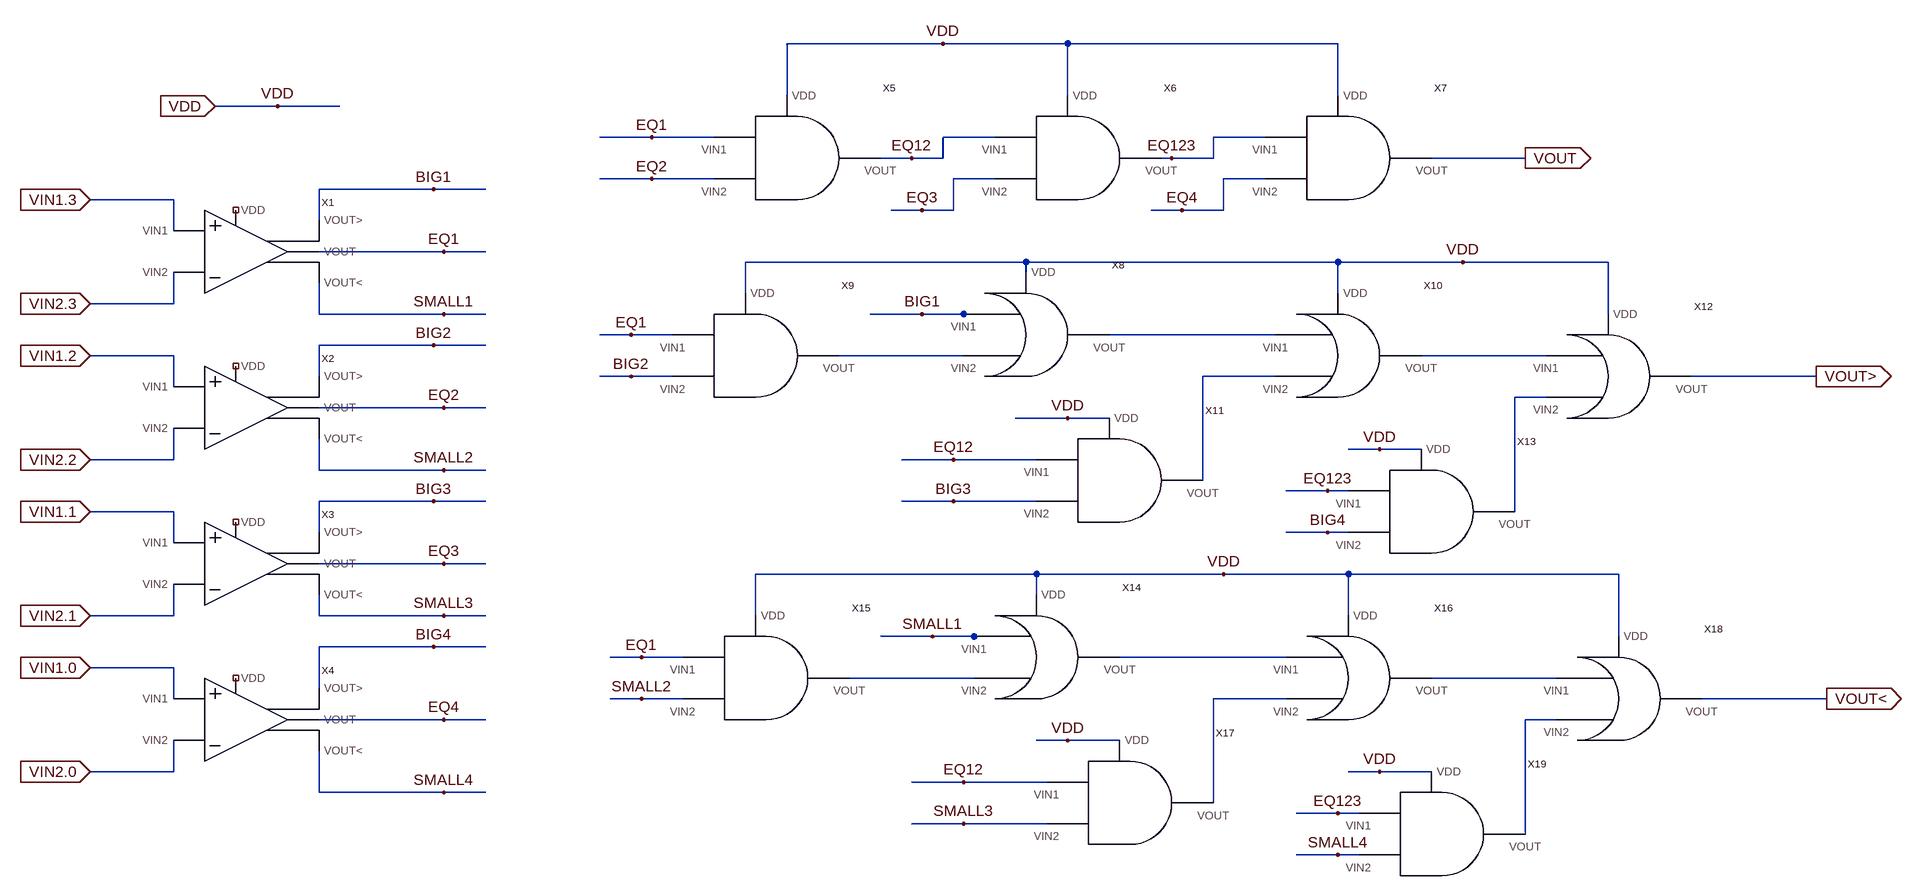
[diagram p0: schematic Comparator4bit.asc]
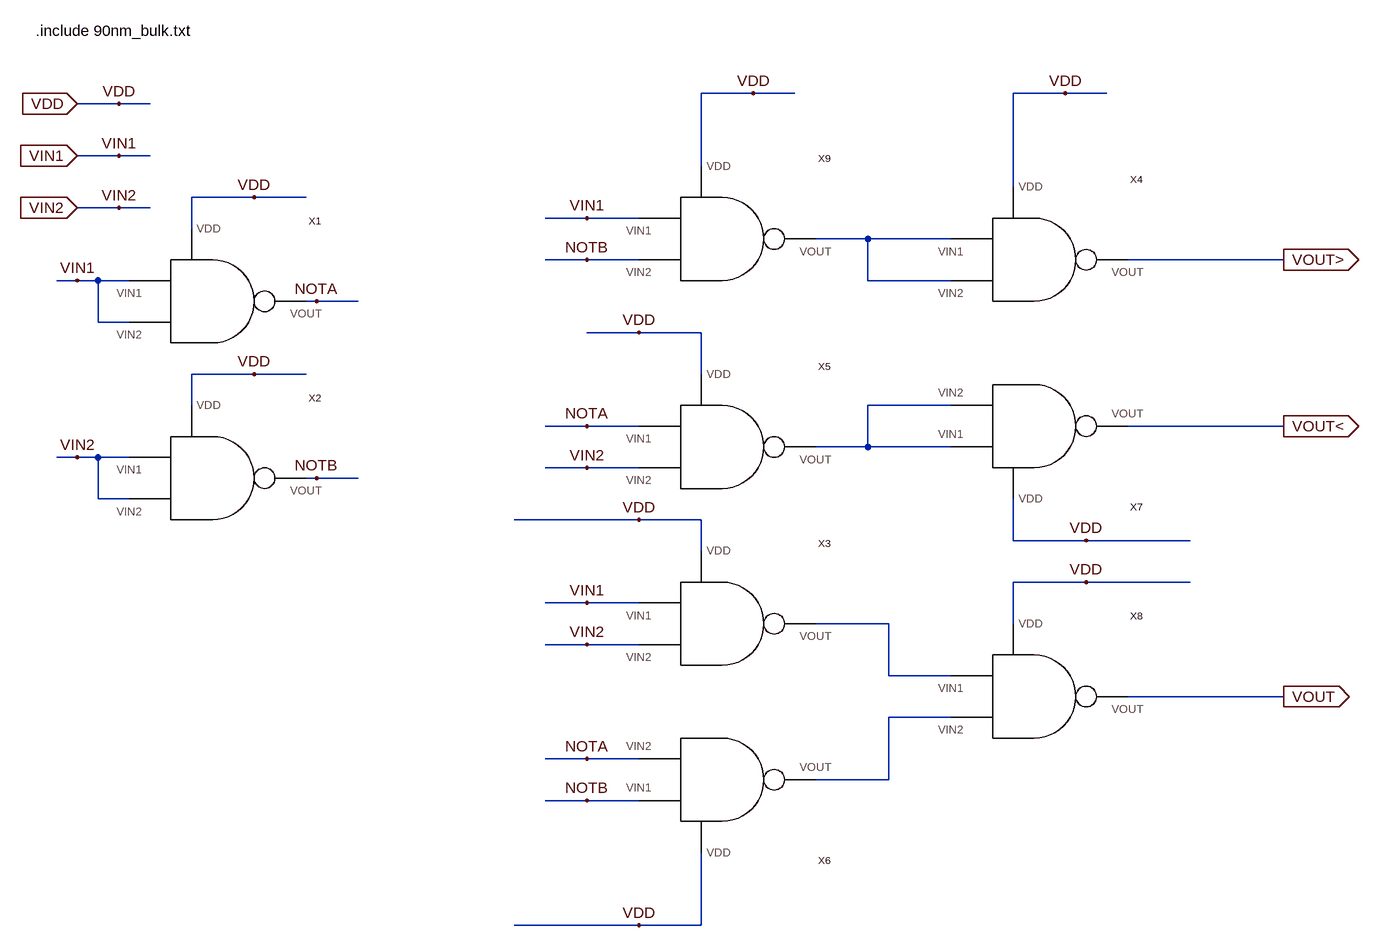
[diagram p1: sub-circuit comparator.asc]
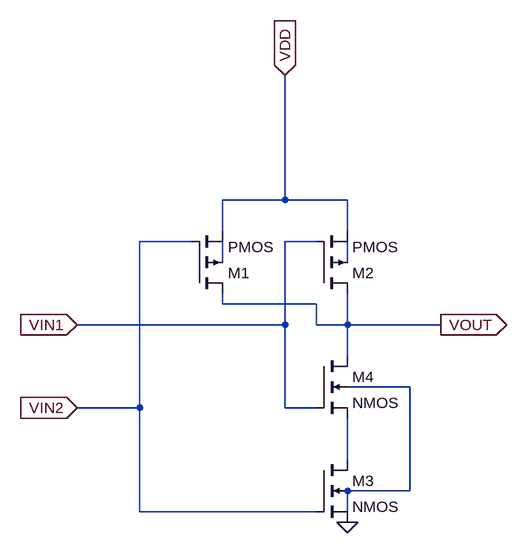
[diagram p2: sub-circuit nand.asc]
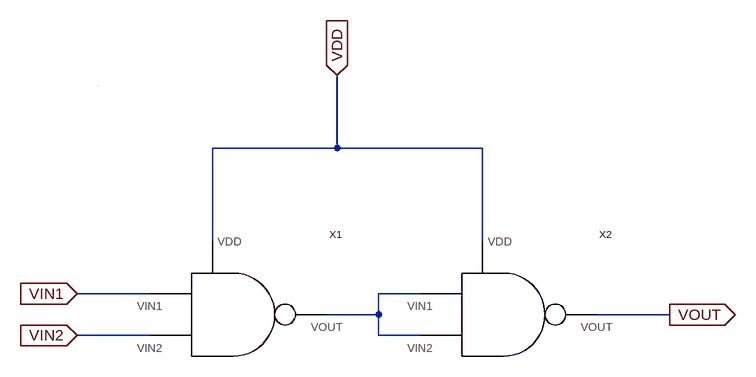
[diagram p3: sub-circuit andbynand.asc]
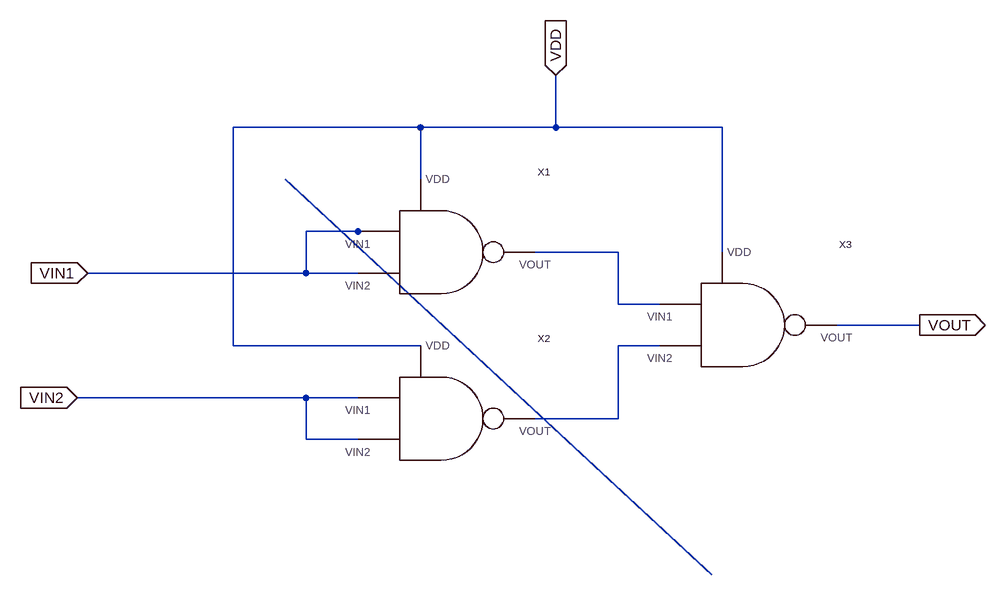
[diagram p4: sub-circuit orbynand.asc]
Comparator4bit.asc, the LTspice schematic file:
Version 4
SHEET 1 3684 1084
WIRE 2160 -208 1920 -208
WIRE 2352 -208 2160 -208
WIRE 2768 -208 2352 -208
WIRE 1920 -128 1920 -208
WIRE 2352 -128 2352 -208
WIRE 2768 -128 2768 -208
WIRE 1136 -112 1040 -112
WIRE 1232 -112 1136 -112
WIRE 1712 -64 1632 -64
WIRE 1808 -64 1712 -64
WIRE 2240 -64 2160 -64
WIRE 2656 -64 2576 -64
WIRE 2112 -32 2064 -32
WIRE 2160 -32 2160 -64
WIRE 2160 -32 2112 -32
WIRE 2512 -32 2496 -32
WIRE 2576 -32 2576 -64
WIRE 2576 -32 2512 -32
WIRE 3056 -32 2912 -32
WIRE 1712 0 1632 0
WIRE 1808 0 1712 0
WIRE 2240 0 2176 0
WIRE 2656 0 2592 0
WIRE 1376 16 1200 16
WIRE 1456 16 1376 16
WIRE 976 32 848 32
WIRE 2128 48 2080 48
WIRE 2176 48 2176 0
WIRE 2176 48 2128 48
WIRE 2528 48 2480 48
WIRE 2592 48 2592 0
WIRE 2592 48 2528 48
WIRE 1200 64 1200 16
WIRE 976 80 976 32
WIRE 1392 112 1200 112
WIRE 1456 112 1392 112
WIRE 2288 128 1856 128
WIRE 2768 128 2288 128
WIRE 2960 128 2768 128
WIRE 3184 128 2960 128
WIRE 2288 144 2288 128
WIRE 1856 176 1856 128
WIRE 2768 176 2768 128
WIRE 976 192 976 144
WIRE 976 192 848 192
WIRE 1200 208 1200 160
WIRE 1392 208 1200 208
WIRE 1456 208 1392 208
WIRE 2128 208 2048 208
WIRE 2192 208 2128 208
WIRE 2208 208 2192 208
WIRE 3184 208 3184 128
WIRE 1680 240 1632 240
WIRE 1744 240 1680 240
WIRE 2672 240 2416 240
WIRE 1376 256 1200 256
WIRE 1456 256 1376 256
WIRE 976 272 848 272
WIRE 2192 272 2000 272
WIRE 3088 272 2896 272
WIRE 1200 304 1200 256
WIRE 1680 304 1632 304
WIRE 1744 304 1680 304
WIRE 2672 304 2560 304
WIRE 3504 304 3312 304
WIRE 976 320 976 272
WIRE 3088 336 3040 336
WIRE 1392 352 1200 352
WIRE 1456 352 1392 352
WIRE 2352 368 2272 368
WIRE 2416 368 2352 368
WIRE 2832 416 2784 416
WIRE 2896 416 2832 416
WIRE 976 432 976 384
WIRE 976 432 848 432
WIRE 2176 432 2096 432
WIRE 2304 432 2176 432
WIRE 1200 448 1200 400
WIRE 1392 448 1200 448
WIRE 1456 448 1392 448
WIRE 2560 464 2560 304
WIRE 2752 480 2688 480
WIRE 2784 480 2752 480
WIRE 1376 496 1200 496
WIRE 1456 496 1376 496
WIRE 2176 496 2096 496
WIRE 2304 496 2176 496
WIRE 976 512 848 512
WIRE 3040 512 3040 336
WIRE 1200 544 1200 496
WIRE 2752 544 2688 544
WIRE 2784 544 2752 544
WIRE 976 560 976 512
WIRE 1392 592 1200 592
WIRE 1456 592 1392 592
WIRE 2304 608 1872 608
WIRE 2592 608 2304 608
WIRE 2784 608 2592 608
WIRE 3200 608 2784 608
WIRE 2304 640 2304 608
WIRE 976 672 976 624
WIRE 976 672 848 672
WIRE 1200 672 1200 640
WIRE 1392 672 1200 672
WIRE 1456 672 1392 672
WIRE 1872 672 1872 608
WIRE 2784 672 2784 608
WIRE 2144 704 2064 704
WIRE 2208 704 2144 704
WIRE 2224 704 2208 704
WIRE 3200 704 3200 608
WIRE 1376 720 1200 720
WIRE 1456 720 1376 720
WIRE 1696 736 1648 736
WIRE 1760 736 1696 736
WIRE 2688 736 2432 736
WIRE 976 752 848 752
WIRE 2208 768 2016 768
WIRE 3104 768 2912 768
WIRE 1200 784 1200 720
WIRE 976 800 976 752
WIRE 1696 800 1648 800
WIRE 1760 800 1696 800
WIRE 2688 800 2576 800
WIRE 3520 800 3328 800
WIRE 1392 832 1200 832
WIRE 1456 832 1392 832
WIRE 3104 832 3056 832
WIRE 2352 864 2304 864
WIRE 2432 864 2352 864
WIRE 976 912 976 864
WIRE 976 912 848 912
WIRE 2832 912 2784 912
WIRE 2912 912 2832 912
WIRE 2192 928 2112 928
WIRE 2320 928 2192 928
WIRE 1200 944 1200 880
WIRE 1392 944 1200 944
WIRE 1456 944 1392 944
WIRE 2576 960 2576 800
WIRE 2768 976 2704 976
WIRE 2800 976 2768 976
WIRE 2192 992 2112 992
WIRE 2320 992 2192 992
WIRE 3056 1008 3056 832
WIRE 2768 1040 2704 1040
WIRE 2800 1040 2768 1040
FLAG 848 752 VIN1.0
IOPIN 848 752 In
FLAG 848 512 VIN1.1
IOPIN 848 512 In
FLAG 848 272 VIN1.2
IOPIN 848 272 In
FLAG 848 32 VIN1.3
IOPIN 848 32 In
FLAG 848 912 VIN2.0
IOPIN 848 912 In
FLAG 848 432 VIN2.2
IOPIN 848 432 In
FLAG 848 672 VIN2.1
IOPIN 848 672 In
FLAG 848 192 VIN2.3
IOPIN 848 192 In
FLAG 1040 -112 VDD
IOPIN 1040 -112 In
FLAG 3056 -32 VOUT
IOPIN 3056 -32 Out
FLAG 3504 304 VOUT>
IOPIN 3504 304 Out
FLAG 3520 800 VOUT<
IOPIN 3520 800 Out
FLAG 1392 112 EQ1
FLAG 1392 352 EQ2
FLAG 1392 592 EQ3
FLAG 1392 832 EQ4
FLAG 1712 -64 EQ1
FLAG 1712 0 EQ2
FLAG 2128 48 EQ3
FLAG 2528 48 EQ4
FLAG 2112 -32 EQ12
FLAG 2512 -32 EQ123
FLAG 1376 16 BIG1
FLAG 1376 256 BIG2
FLAG 1376 496 BIG3
FLAG 1376 720 BIG4
FLAG 2128 208 BIG1
FLAG 1680 240 EQ1
FLAG 1680 304 BIG2
FLAG 2176 432 EQ12
FLAG 2176 496 BIG3
FLAG 2752 480 EQ123
FLAG 2752 544 BIG4
FLAG 2144 704 SMALL1
FLAG 1696 736 EQ1
FLAG 1696 800 SMALL2
FLAG 2192 928 EQ12
FLAG 2192 992 SMALL3
FLAG 2768 976 EQ123
FLAG 2768 1040 SMALL4
FLAG 1392 208 SMALL1
FLAG 1392 448 SMALL2
FLAG 1392 672 SMALL3
FLAG 1392 944 SMALL4
FLAG 1136 -112 VDD
FLAG 2160 -208 VDD
FLAG 2960 128 VDD
FLAG 2352 368 VDD
FLAG 2832 416 VDD
FLAG 2592 608 VDD
FLAG 2352 864 VDD
FLAG 2832 912 VDD
SYMBOL Comparator 1072 112 R0
SYMATTR InstName X1
SYMBOL Comparator 1072 352 R0
SYMATTR InstName X2
SYMBOL Comparator 1072 592 R0
SYMATTR InstName X3
SYMBOL Comparator 1072 832 R0
SYMATTR InstName X4
SYMBOL ANDbyNAND 1920 -32 R0
SYMATTR InstName X5
SYMBOL ANDbyNAND 2352 -32 R0
SYMATTR InstName X6
SYMBOL ANDbyNAND 2768 -32 R0
SYMATTR InstName X7
SYMBOL ORbyNAND 2272 240 R0
SYMATTR InstName X8
SYMBOL ANDbyNAND 1856 272 R0
SYMATTR InstName X9
SYMBOL ORbyNAND 2752 272 R0
SYMATTR InstName X10
SYMBOL ANDbyNAND 2416 464 R0
SYMATTR InstName X11
SYMBOL ORbyNAND 3168 304 R0
SYMATTR InstName X12
SYMBOL ANDbyNAND 2896 512 R0
SYMATTR InstName X13
SYMBOL ORbyNAND 2288 736 R0
SYMATTR InstName X14
SYMBOL ANDbyNAND 1872 768 R0
SYMATTR InstName X15
SYMBOL ORbyNAND 2768 768 R0
SYMATTR InstName X16
SYMBOL ANDbyNAND 2432 960 R0
SYMATTR InstName X17
SYMBOL ORbyNAND 3184 800 R0
SYMATTR InstName X18
SYMBOL ANDbyNAND 2912 1008 R0
SYMATTR InstName X19

comparator.asc, the sub-circuit schematic file:
Version 4
SHEET 1 1184 892
WIRE 224 -432 144 -432
WIRE 288 -432 224 -432
WIRE 704 -432 624 -432
WIRE 768 -432 704 -432
WIRE -752 -416 -816 -416
WIRE -704 -416 -752 -416
WIRE -752 -336 -816 -336
WIRE -704 -336 -752 -336
WIRE 144 -320 144 -432
WIRE 624 -288 624 -432
WIRE -544 -272 -640 -272
WIRE -464 -272 -544 -272
WIRE -752 -256 -816 -256
WIRE -704 -256 -752 -256
WIRE -32 -240 -96 -240
WIRE 48 -240 -32 -240
WIRE -640 -224 -640 -272
WIRE 400 -208 320 -208
WIRE 528 -208 400 -208
WIRE -32 -176 -96 -176
WIRE 48 -176 -32 -176
WIRE 1040 -176 800 -176
WIRE -816 -144 -848 -144
WIRE -784 -144 -816 -144
WIRE -736 -144 -784 -144
WIRE 400 -144 400 -208
WIRE 528 -144 400 -144
WIRE -448 -112 -464 -112
WIRE -384 -112 -448 -112
WIRE -784 -80 -784 -144
WIRE -736 -80 -784 -80
WIRE 48 -64 -32 -64
WIRE 144 -64 48 -64
WIRE -544 0 -640 0
WIRE -464 0 -544 0
WIRE 144 0 144 -64
WIRE -640 48 -640 0
WIRE 528 48 400 48
WIRE -32 80 -96 80
WIRE 48 80 -32 80
WIRE 1040 80 800 80
WIRE 400 112 400 48
WIRE 400 112 320 112
WIRE 528 112 400 112
WIRE -816 128 -848 128
WIRE -784 128 -816 128
WIRE -736 128 -784 128
WIRE -32 144 -96 144
WIRE 48 144 -32 144
WIRE -448 160 -464 160
WIRE -384 160 -448 160
WIRE -784 192 -784 128
WIRE -736 192 -784 192
WIRE 48 224 -144 224
WIRE 144 224 48 224
WIRE 624 256 624 192
WIRE 736 256 624 256
WIRE 896 256 736 256
WIRE 144 272 144 224
WIRE 736 320 624 320
WIRE 896 320 736 320
WIRE -32 352 -96 352
WIRE 48 352 -32 352
WIRE 432 384 320 384
WIRE 624 384 624 320
WIRE -32 416 -96 416
WIRE 48 416 -32 416
WIRE 432 464 432 384
WIRE 528 464 432 464
WIRE 1040 496 800 496
WIRE 528 528 432 528
WIRE -32 592 -96 592
WIRE 48 592 -32 592
WIRE 432 624 432 528
WIRE 432 624 320 624
WIRE -32 656 -96 656
WIRE 48 656 -32 656
WIRE 48 848 -144 848
WIRE 144 848 144 736
WIRE 144 848 48 848
FLAG -816 -336 VIN1
IOPIN -816 -336 In
FLAG -816 -256 VIN2
IOPIN -816 -256 In
FLAG 1040 496 VOUT
IOPIN 1040 496 Out
FLAG 1040 -176 VOUT>
IOPIN 1040 -176 Out
FLAG 1040 80 VOUT<
IOPIN 1040 80 Out
FLAG -752 -336 VIN1
FLAG -752 -256 VIN2
FLAG -816 -144 VIN1
FLAG -448 -112 NOTA
FLAG -816 128 VIN2
FLAG -448 160 NOTB
FLAG -32 -240 VIN1
FLAG -32 -176 NOTB
FLAG -32 80 NOTA
FLAG -32 144 VIN2
FLAG -32 352 VIN1
FLAG -32 416 VIN2
FLAG -32 592 NOTA
FLAG -32 656 NOTB
FLAG -816 -416 VDD
IOPIN -816 -416 In
FLAG -752 -416 VDD
FLAG -544 -272 VDD
FLAG -544 0 VDD
FLAG 48 -64 VDD
FLAG 224 -432 VDD
FLAG 704 -432 VDD
FLAG 48 224 VDD
FLAG 736 256 VDD
FLAG 736 320 VDD
FLAG 48 848 VDD
SYMBOL NAND -624 -112 R0
SYMATTR InstName X1
SYMBOL NAND -624 160 R0
SYMATTR InstName X2
SYMBOL NAND 160 384 R0
SYMATTR InstName X3
SYMBOL NAND 640 -176 R0
SYMATTR InstName X4
SYMBOL NAND 160 112 R0
SYMATTR InstName X5
SYMBOL NAND 160 624 M180
SYMATTR InstName X6
SYMBOL NAND 640 80 M180
SYMATTR InstName X7
SYMBOL NAND 640 496 R0
SYMATTR InstName X8
SYMBOL NAND 160 -208 R0
SYMATTR InstName X9
TEXT -880 -528 Left 2 !.include 90nm_bulk.txt

nand.asc, the sub-circuit schematic file:
Version 4
SHEET 1 880 680
WIRE 32 -64 32 -256
WIRE 32 -64 -64 -64
WIRE 128 -64 32 -64
WIRE -64 -16 -64 -64
WIRE 128 -16 128 -64
WIRE -112 0 -192 0
WIRE 80 0 32 0
WIRE -64 32 -64 0
WIRE 128 32 128 0
WIRE -64 96 -64 80
WIRE 80 96 -64 96
WIRE 32 128 32 0
WIRE 32 128 -288 128
WIRE 80 128 80 96
WIRE 128 128 128 80
WIRE 128 128 80 128
WIRE 272 128 128 128
WIRE 128 176 128 128
WIRE 224 224 128 224
WIRE -192 256 -192 0
WIRE -192 256 -288 256
WIRE 32 256 32 128
WIRE 80 256 32 256
WIRE 128 336 128 272
WIRE 224 384 224 224
WIRE 224 384 128 384
WIRE -192 416 -192 256
WIRE 80 416 -192 416
WIRE 128 416 128 384
FLAG 128 432 0
FLAG -288 128 VIN1
IOPIN -288 128 In
FLAG -288 256 VIN2
IOPIN -288 256 In
FLAG 32 -256 VDD
IOPIN 32 -256 In
FLAG 272 128 VOUT
IOPIN 272 128 Out
SYMBOL pmos4 -112 80 M180
SYMATTR InstName M1
SYMATTR Value2 l=90n w=400n
SYMBOL pmos4 80 80 M180
SYMATTR InstName M2
SYMATTR Value2 l=90n w=400n
SYMBOL nmos4 80 336 R0
SYMATTR InstName M3
SYMATTR Value2 l=90n w=200n
SYMBOL nmos4 80 176 R0
SYMATTR InstName M4
SYMATTR Value2 l=90n w=200n

andbynand.asc, the sub-circuit schematic file:
Version 4
SHEET 1 1004 680
WIRE 368 96 368 -16
WIRE 368 96 176 96
WIRE 592 96 368 96
WIRE 176 240 176 96
WIRE 592 240 592 96
WIRE 80 320 -32 320
WIRE 496 320 432 320
WIRE 432 352 432 320
WIRE 432 352 352 352
WIRE 880 352 768 352
WIRE 80 384 -32 384
WIRE 432 384 432 352
WIRE 496 384 432 384
WIRE 0 0 0 0
FLAG -32 320 VIN1
IOPIN -32 320 In
FLAG -32 384 VIN2
IOPIN -32 384 In
FLAG 880 352 VOUT
IOPIN 880 352 Out
FLAG 368 -16 VDD
IOPIN 368 -16 In
SYMBOL NAND 192 352 R0
SYMATTR InstName X1
SYMBOL NAND 608 352 R0
SYMATTR InstName X2

orbynand.asc, the sub-circuit schematic file:
Version 4
SHEET 1 1100 680
WIRE 208 -80 -80 -80
WIRE 416 -80 416 -160
WIRE 416 -80 208 -80
WIRE 672 -80 416 -80
WIRE 208 0 208 -80
WIRE 112 80 32 80
WIRE 128 80 112 80
WIRE 512 112 384 112
WIRE 672 112 672 -80
WIRE 32 144 32 80
WIRE 32 144 -304 144
WIRE 112 144 32 144
WIRE 512 192 512 112
WIRE 576 192 512 192
WIRE 976 224 848 224
WIRE -80 256 -80 -80
WIRE 208 256 -80 256
WIRE 576 256 512 256
WIRE 32 336 -320 336
WIRE 112 336 32 336
WIRE 512 368 512 256
WIRE 512 368 384 368
WIRE 32 400 32 336
WIRE 112 400 32 400
WIRE 656 608 0 0
FLAG -304 144 VIN1
IOPIN -304 144 In
FLAG -320 336 VIN2
IOPIN -320 336 In
FLAG 416 -160 VDD
IOPIN 416 -160 In
FLAG 976 224 VOUT
IOPIN 976 224 Out
SYMBOL NAND 224 112 R0
SYMATTR InstName X1
SYMBOL NAND 224 368 R0
SYMATTR InstName X2
SYMBOL NAND 688 224 R0
SYMATTR InstName X3

The netlist it stands for:
* Comparator4bit.asc
XX1 VIN1.3 VIN2.3 EQ1 NC_01 BIG1 SMALL1 comparator
XX2 VIN1.2 VIN2.2 EQ2 NC_02 BIG2 SMALL2 comparator
XX3 VIN1.1 VIN2.1 EQ3 NC_03 BIG3 SMALL3 comparator
XX4 VIN1.0 VIN2.0 EQ4 NC_04 BIG4 SMALL4 comparator
XX5 EQ12 EQ1 EQ2 VDD andbynand
XX6 EQ123 EQ12 EQ3 VDD andbynand
XX7 VOUT EQ123 EQ4 VDD andbynand
XX8 N001 N002 BIG1 VDD orbynand
XX9 N002 EQ1 BIG2 VDD andbynand
XX10 N003 N004 N001 VDD orbynand
XX11 N004 EQ12 BIG3 VDD andbynand
XX12 VOUT> N005 N003 VDD orbynand
XX13 N005 EQ123 BIG4 VDD andbynand
XX14 N006 N007 SMALL1 VDD orbynand
XX15 N007 EQ1 SMALL2 VDD andbynand
XX16 N008 N009 N006 VDD orbynand
XX17 N009 EQ12 SMALL3 VDD andbynand
XX18 VOUT< N010 N008 VDD orbynand
XX19 N010 EQ123 SMALL4 VDD andbynand

* block symbol definitions
.subckt comparator VIN1 VIN2 VOUT VDD VOUT> VOUT<
XX1 VDD VIN1 NOTA VIN1 nand
XX2 VDD VIN2 NOTB VIN2 nand
XX3 VDD VIN1 N003 VIN2 nand
XX4 VDD N001 VOUT> N001 nand
XX5 VDD NOTA N002 VIN2 nand
XX6 VDD NOTB N004 NOTA nand
XX7 VDD N002 VOUT< N002 nand
XX8 VDD N003 VOUT N004 nand
XX9 VDD VIN1 N001 NOTB nand
.include 90nm_bulk.txt
.ends comparator

.subckt nand VDD VIN1 VOUT VIN2
M1 VOUT VIN2 VDD N001 PMOS l=90n w=400n
M2 VOUT VIN1 VDD N002 PMOS l=90n w=400n
M3 N004 VIN2 0 N003 NMOS l=90n w=200n
M4 VOUT VIN1 N004 N003 NMOS l=90n w=200n
.ends nand

.subckt andbynand VOUT VIN1 VIN2 VDD
XX1 VDD VIN1 N001 VIN2 nand
XX2 VDD N001 VOUT N001 nand
.ends andbynand

.subckt orbynand VOUT VIN2 VIN1 VDD
XX1 VDD VIN1 N001 VIN1 nand
XX2 VDD VIN2 N002 VIN2 nand
XX3 VDD N001 VOUT N002 nand
.ends orbynand

.model NMOS NMOS
.model PMOS PMOS
.lib standard.mos
.backanno
.end